# Altium schematic sheet Audio.SchDoc: LiveDesign Evaluation - EvalBoard Tester
size A4; Organization: Altium Limited; Address1: L3, 12a Rodborough Rd; Address2: Frenchs Forest; Address3: NSW; Address4: Australia 2086; DocumentNumber: 2; SheetNumber: 2; SheetTotal: 16
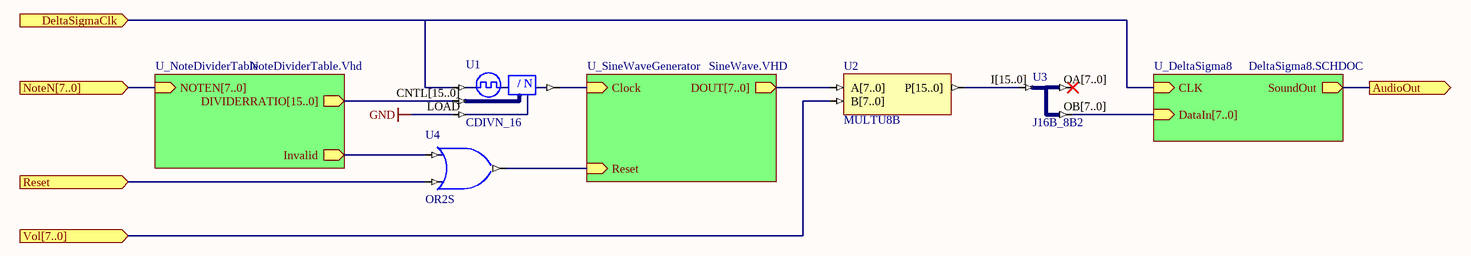
[diagram p0: Audio.SchDoc]

## Parts
U1  CDIVN_16
U2  MULTU8B
U3  J16B_8B2
U4  OR2S

## Sub-sheets
U_DeltaSigma8 = DeltaSigma8.SCHDOC: CLK (in), DataIn[7..0] (in), SoundOut (out)
U_NoteDividerTable = NoteDividerTable.Vhd: DIVIDERRATIO[15..0] (out), NOTEN[7..0] (in), Invalid (out)  | VHDLENTITY: NoteDividerTable
U_SineWaveGenerator = SineWave.VHD: Clock (in), DOUT[7..0] (out), Reset (in)  | VHDLENTITY: SineWaveGenerator

## Ports
AudioOut (out), DeltaSigmaClk (in), NoteN[7..0] (in), Reset (in), Vol[7..0] (in)

## Nets
GND: U1.LOAD
AudioOut: port AudioOut, sheet U_DeltaSigma8/SoundOut
DeltaSigmaClk: U1.CLKIN ; port DeltaSigmaClk, sheet U_DeltaSigma8/CLK
Reset: U4.I1 ; port Reset
Vol[7..0]: U2.B[7..0] ; port Vol[7..0]
NetU1_CLKDV: U1.CLKDV ; sheet U_SineWaveGenerator/Clock
NetU1_CNTL[15..0]: U1.CNTL[15..0] ; sheet U_NoteDividerTable/DIVIDERRATIO[15..0]
NetU2_A[7..0]: U2.A[7..0] ; sheet U_SineWaveGenerator/DOUT[7..0]
NetU2_P[15..0]: U2.P[15..0] U3.I[15..0]
NetU3_OB[7..0]: U3.OB[7..0] ; sheet U_DeltaSigma8/DataIn[7..0]
NetU4_I0: U4.I0 ; sheet U_NoteDividerTable/Invalid
NetU4_O: U4.O ; sheet U_SineWaveGenerator/Reset

Not connected (* = marked no-connect by the designer): U3 OA[7..0]*

## Buses and harness runs
bus port NoteN[7..0] = sheet U_NoteDividerTable/NOTEN[7..0]

## Notes on the sheet
- Title
- Size:
- Date:
- A4
- Number:
- Time:
- Revision:
- Sheet
- of
- File:
- (in symbol CDIVN_16) / N

## Library data of the parts
U1 = CDIVN_16: 16-Bit Programmable Clock Divider; ArchiveName: GENERIC; VHDLIB_SIM: GENERIC_LIB; Published: 29-Jan-2004; Publisher: Altium Limited; Core Revision: 1.00.00
U2 = MULTU8B: 8x8 Unsigned Multiplier, Bus Version; Functional Class: Arithmetic Function; Sub Class: MULTU; Port Size: 8; ArchiveName: GENERIC; VHDLIB_SIM: GENERIC_LIB; Published: 29-Jan-2004; Publisher: Altium Limited; Core Revision: 1.00.00; HelpURL: CR0118 FPGA Generic Library Guide.pdf#page=394; Port Style: Bus Version
U3 = J16B_8B2: 1 x 16-bit input bus to 2 x 8-Bit output bus; Functional Class: Bus Joiner; Port Size: 16; ArchiveName: GENERIC; VHDLIB_SIM: GENERIC_LIB; Published: 29-Jan-2004; Publisher: Altium Limited; Core Revision: 1.00.00; HelpURL: CR0118 FPGA Generic Library Guide.pdf#page=297
U4 = OR2S: 2-Input OR Gate, Single Pin Version; ArchiveName: GENERIC; VHDLIB_SIM: GENERIC_LIB; XilinxEquivalent: OR2; FunctionalClass: Logic Primitive; PortSize: 2; Published: 29-Jan-2004; Publisher: Altium Limited; HelpURL: CR0118 FPGA Generic Library Guide.pdf#page=404; Revision: 1.00.00; SubClass: OR; PortStyle: Single Pin Version